# EAGLE design LiPo Battery Meter (EAGLE 6.5.0)
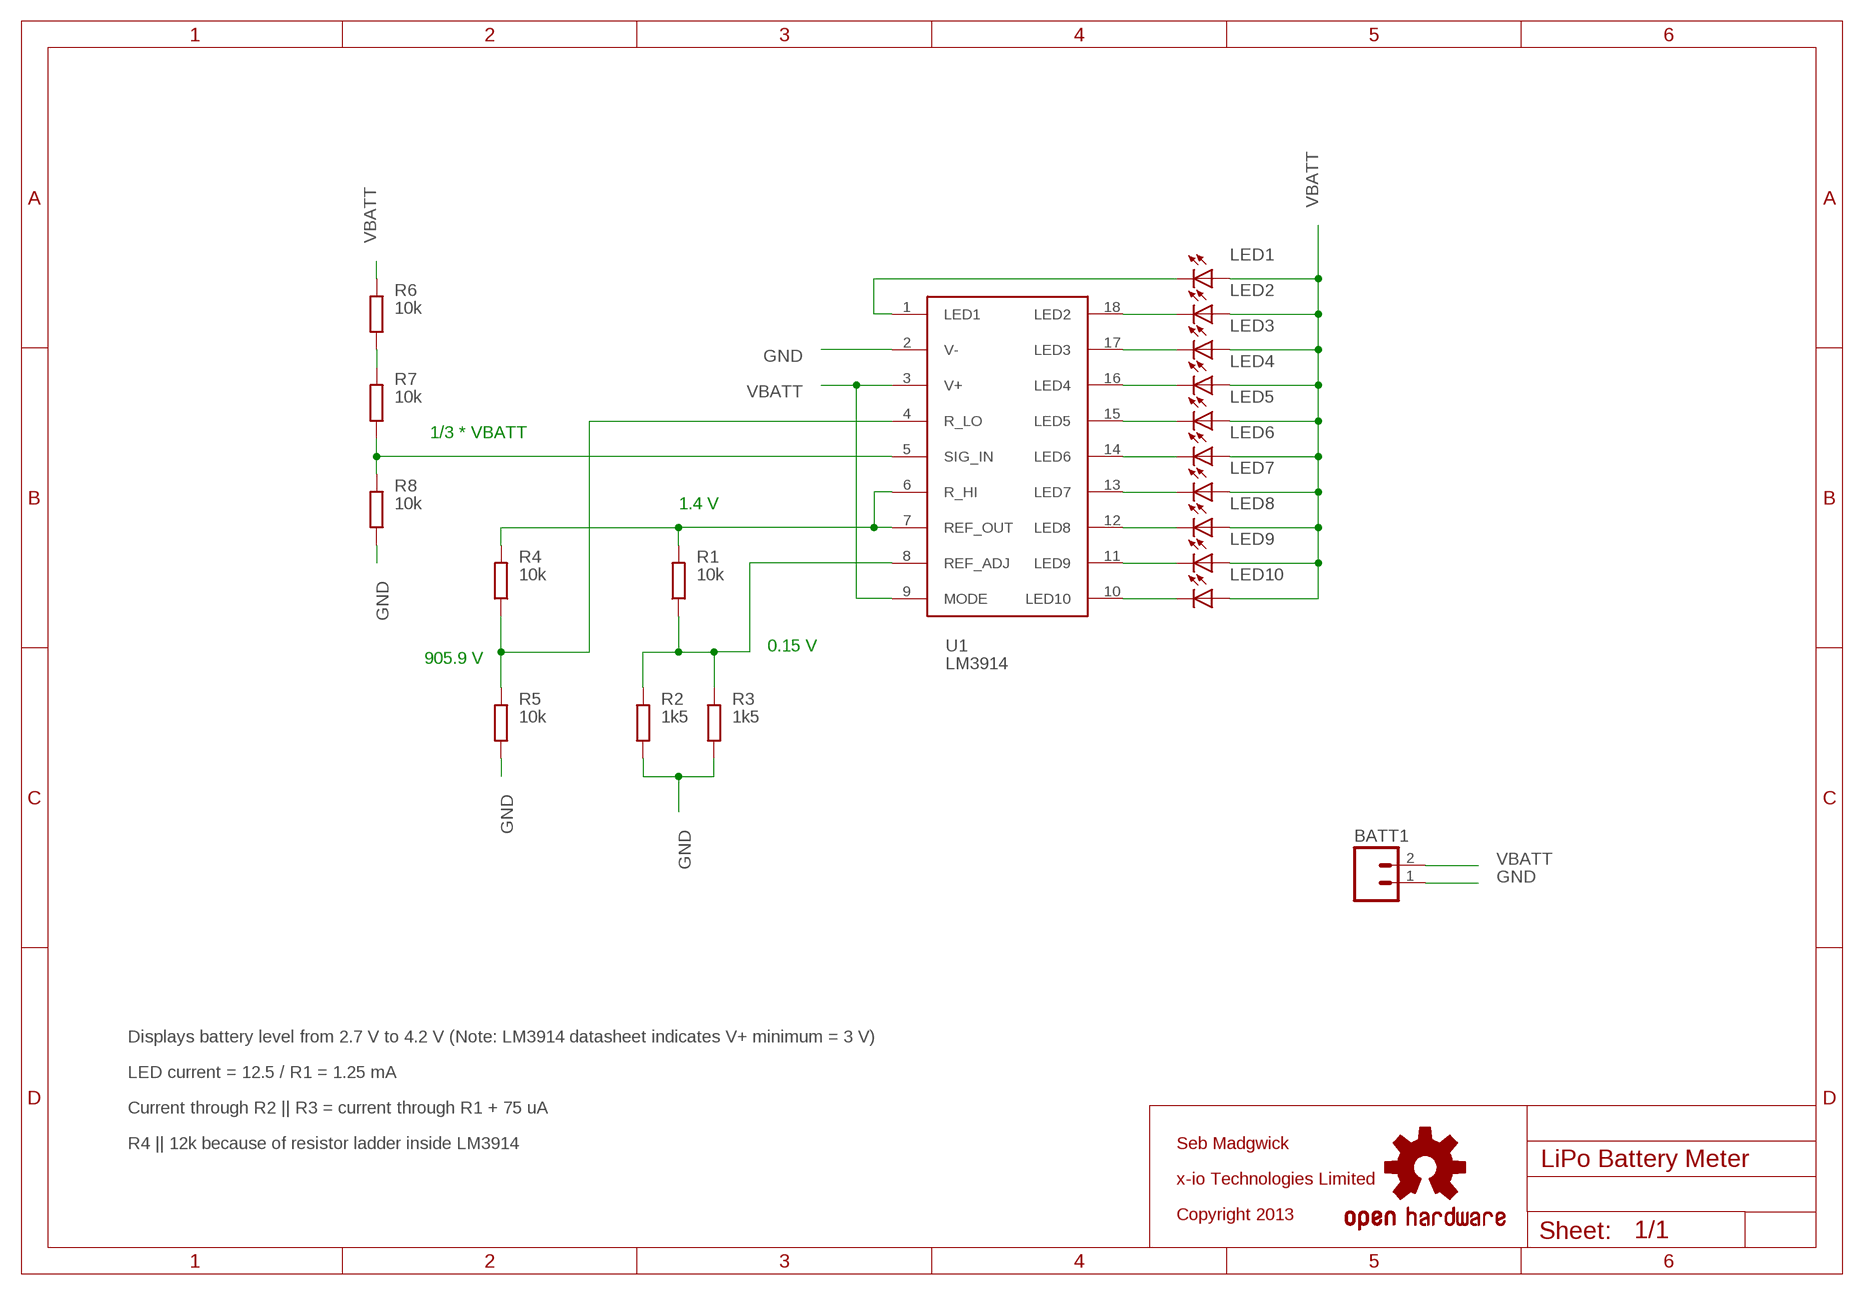
[diagram p0: schematic, sheet 1]

## Parts
BATT1  M02-JST-2MM-SMT  [S2B-PH]
LED1  LEDCHIPLED_1206  [CHIPLED_1206]
LED2  LEDCHIPLED_1206  [CHIPLED_1206]
LED3  LEDCHIPLED_1206  [CHIPLED_1206]
LED4  LEDCHIPLED_1206  [CHIPLED_1206]
LED5  LEDCHIPLED_1206  [CHIPLED_1206]
LED6  LEDCHIPLED_1206  [CHIPLED_1206]
LED7  LEDCHIPLED_1206  [CHIPLED_1206]
LED8  LEDCHIPLED_1206  [CHIPLED_1206]
LED9  LEDCHIPLED_1206  [CHIPLED_1206]
LED10  LEDCHIPLED_1206  [CHIPLED_1206]
R1  10k  R-EU_M1206  [M1206]
R2  1k5  R-EU_M1206  [M1206]
R3  1k5  R-EU_M1206  [M1206]
R4  10k  R-EU_M1206  [M1206]
R5  10k  R-EU_M1206  [M1206]
R6  10k  R-EU_M1206  [M1206]
R7  10k  R-EU_M1206  [M1206]
R8  10k  R-EU_M1206  [M1206]
U1  LM3914  [DIL18]
U$2  OSHW-LOGOM  [OSHW-LOGO-M]

## Nets
GND: BATT1.1 R2.1 R3.1 R5.1 R8.1 U1.2(V-)
N$2: R4.1 R5.2 U1.4(R_LO)
N$4: R7.1 R8.2 U1.5(SIG_IN)
N$5: R6.1 R7.2
N$6: R1.1 R2.2 R3.2 U1.8(REF_ADJ)
N$7: LED10.C U1.10(LED10)
N$8: LED9.C U1.11(LED9)
N$9: LED8.C U1.12(LED8)
N$10: LED7.C U1.13(LED7)
N$11: LED6.C U1.14(LED6)
N$12: LED5.C U1.15(LED5)
N$13: LED4.C U1.16(LED4)
N$14: LED3.C U1.17(LED3)
N$15: LED2.C U1.18(LED2)
N$16: LED1.C U1.1(LED1)
REF_OUT: R1.2 R4.2 U1.6(R_HI) U1.7(REF_OUT)
VBATT: BATT1.2 LED1.A LED2.A LED3.A LED4.A LED5.A LED6.A LED7.A LED8.A LED9.A LED10.A R6.2 U1.3(V+) U1.9(MODE)

## Notes on the sheet
- 1/3 * VBATT
- 1.4 V
- 905.9 V | 0.15 V
- Displays battery level from 2.7 V to 4.2 V (Note: LM3914 datasheet indicates V+ minimum = 3 V)
- LED current = 12.5 / R1 = 1.25 mA
- Current through R2 || R3 = current through R1 + 75 uA
- R4 || 12k because of resistor ladder inside LM3914 | Seb Madgwick
- x-io Technologies Limited
- Copyright 2013

## Library data of the parts
BATT1 = SparkFun:M02: Header 2 Standard 2-pin 0.1" header. Use with straight break away headers (SKU : PRT-00116), right angle break away headers (PRT-00553), swiss pins (PRT-00743), machine pins (PRT-00117), and female headers (PRT-00115). Molex polarized connector foot print use with SKU : PRT-08233 with associated crimp pins and housings.
LED1-LED10 = led:LED: LED OSRAM: - CHIPLED LG R971, LG N971, LY N971, LG Q971, LY Q971, LO R971, LY R971 LH N974, LH R974 LS Q976, LO Q976, LY Q976 LO Q996 - Hyper CHIPLED LW Q18S LB Q993, LB Q99A, LB R99A - SideLED LS A670, LO A670, LY A670, LG A670, LP A670 LB A673, LV A673, LT A673, LW A673 LH A674 LY A675 LS A676, LA A676, LO A676, LY A676, LW A676 LS A679, LY A679, LG A679 - Hyper Micro SIDELED® LS Y876, LA Y876, LO Y876, LY Y876 LT Y87S - SmartLED LW L88C, LW L88S LB L89C, LB L89S, LG L890 LS L89K, LO L89K, LY L89K LS L896, LA L896, LO L896, LY L896 - TOPLED LS T670, LO T670, LY T670, LG T670, LP T670 LSG T670, LSP T670, LSY T670, LOP T670, LYG T670 LG T671, LOG T671, LSG T671 LB T673, LV T673, LT T673, LW T673 LH T674 LS T676, LA T676, LO T676, LY T676, LB T676, LH T676, LSB T676, LW T676 LB T67C, LV T67C, LT T67C, LS T67K, LO T67K, LY T67K, LW E67C LS E67B, LA E67B, LO E67B, LY E67B, LB E67C, LV E67C, LT E67C LW T67C LS T679, LY T679, LG T679 LS T770, LO T770, LY T770, LG T770, LP T770 LB T773, LV T773, LT T773, LW T773 LH T774 LS E675, LA E675, LY E675, LS T675 LS T776, LA T776, LO T776, LY T776, LB T776 LHGB T686 LT T68C, LB T68C - Hyper Mini TOPLED® LB M676 - Mini TOPLED Santana® LG M470 LS M47K, LO M47K, LY M47K Source: http://www.osram.convergy.de - LUMILED® LXK2-PW12-R00, LXK2-PW12-S00, LXK2-PW14-U00, LXK2-PW14-V00 LXK2-PM12-R00, LXK2-PM12-S00, LXK2-PM14-U00 LXK2-PE12-Q00, LXK2-PE12-R00, LXK2-PE12-S00, LXK2-PE14-T00, LXK2-PE14-U00 LXK2-PB12-K00, LXK2-PB12-L00, LXK2-PB12-M00, LXK2-PB14-N00, LXK2-PB14-P00, LXK2-PB14-Q00 LXK2-PR12-L00, LXK2-PR12-M00, LXK2-PR14-Q00, LXK2-PR14-R00 LXK2-PD12-Q00, LXK2-PD12-R00, LXK2-PD12-S00 LXK2-PH12-R00, LXK2-PH12-S00 LXK2-PL12-P00, LXK2-PL12-Q00, LXK2-PL12-R00 Source: www.luxeon.com
R1-R8 = rcl:R-EU_: RESISTOR, European symbol
U1 = x-io:LM3914
U$2 = SparkFun_08_2011:OSHW-LOGO: Open Source Hardware Logo This logo indicates the piece of hardware it is found on incorporates a OSHW license and/or adheres to the definition of open source hardware found here: http://freedomdefined.org/OSHW

## Board
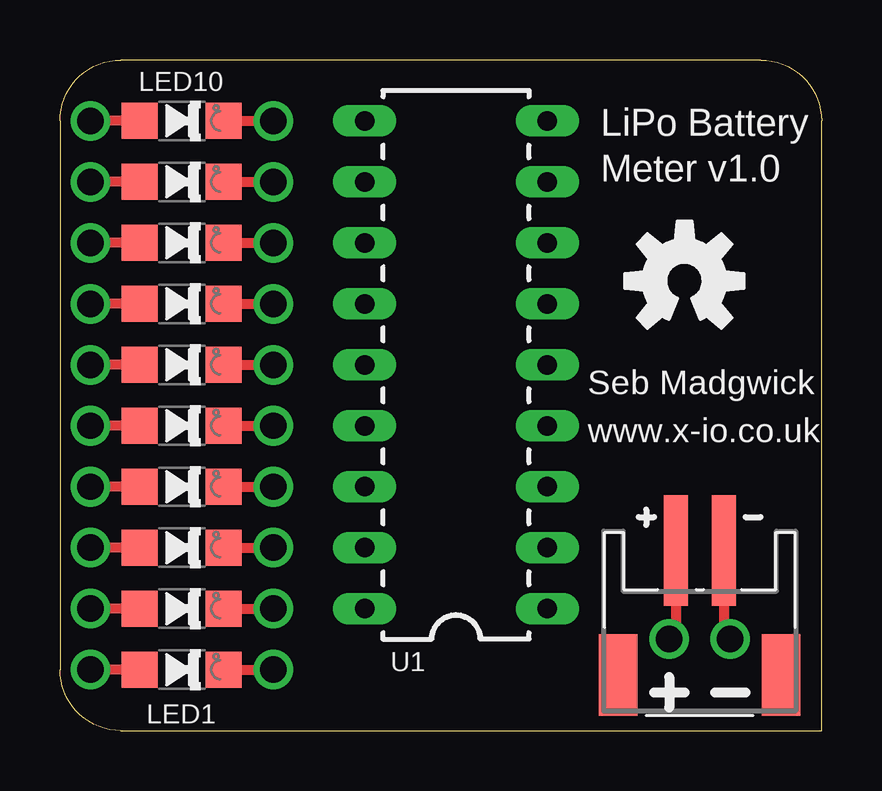
[diagram p1: board, top side]
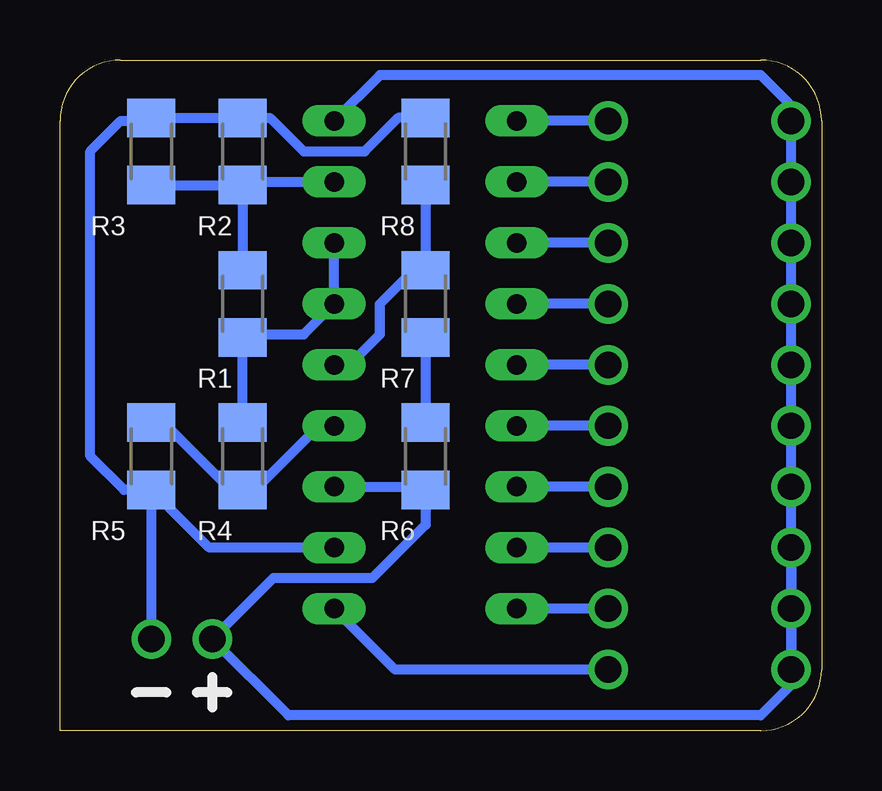
[diagram p2: board, bottom side, seen from below]

Size 31.75 x 27.94 mm. Coordinates in mm from the lower left corner, seen from the top.
Outline: 2.54,0 31.75,0 31.75,25.4 arc90 29.21,27.94 2.54,27.94 arc90 0,25.4 0,2.54 arc90 2.54,0
Copper layers (1*16): Top 0.035mm / dielectric 1.5mm / Bottom 0.035mm
Design rules "default *": minimum track width 0.15mm, minimum drill 0.3mm, track to track 0.15mm, track to pad 0.15mm, pad to pad 0.15mm, via to via 0.15mm, smd to smd 0.15mm, copper to edge 0.2mm, drill to drill 0.15mm, minimum pad ring 10mil, minimum via ring 8mil, stop-mask expansion 4mil, vias tented up to drill 1mm, thermal gap 0.195mm

### Footprints (pad centres in the part's own frame; a part is rotated, then mirrored left to right if it is on the bottom)
S2B-PH = smd 1 x 4.6: 1 -1,-3.7; 2 1,-3.7 | smd 1.6 x 3.4: NC1 -3.4,1.5; NC2 3.4,1.5
CHIPLED_1206 = smd 1.5 x 1.5: A 0,-1.75; C 0,1.75
M1206 = smd 1.6 x 2: 1 -1.4,0; 2 1.4,0
DIL18 = drill 0.813 long: 1 -10.16,-3.81; 2 -7.62,-3.81; 3 -5.08,-3.81; 4 -2.54,-3.81; 5 0,-3.81; 6 2.54,-3.81; 7 5.08,-3.81; 8 7.62,-3.81; 9 10.16,-3.81; 10 10.16,3.81; 11 7.62,3.81; 12 5.08,3.81; 13 2.54,3.81; 14 0,3.81; 15 -2.54,3.81; 16 -5.08,3.81; 17 -7.62,3.81; 18 -10.16,3.81

### Placement (x,y rotation side)
BATT1  26.67,3.81 180 top
LED1  5.08,2.54 270 top
LED2  5.08,5.08 270 top
LED3  5.08,7.62 270 top
LED4  5.08,10.16 270 top
LED5  5.08,12.7 270 top
LED6  5.08,15.24 270 top
LED7  5.08,17.78 270 top
LED8  5.08,20.32 270 top
LED9  5.08,22.86 270 top
LED10  5.08,25.4 270 top
R1  24.13,17.78 270 bottom
R2  24.13,24.13 270 bottom
R3  27.94,24.13 270 bottom
R4  24.13,11.43 90 bottom
R5  27.94,11.43 90 bottom
R6  16.51,11.43 270 bottom
R7  16.51,17.78 270 bottom
R8  16.51,24.13 270 bottom
U1  16.51,15.24 90 top
U$1  [LIPO_BATTERY_METER_V1_0_BOTTOM]  0,0 0 top
U$2  26.04,18.73 0 top
U$3  [LIPO_BATTERY_METER_V1_0_TOP]  0,0 0 top

### Tracks (layer width: path | path; a pad name or v marks a point on that pad's centre or on a via)
GND  (via drill 1.1 pad 1.42)
  Top 0.406: BATT1.1 27.67,4.08 v27.94,3.81
  Bottom 0.406: U1.2 25.53,7.62 R5.1 | R5.1 v27.94,3.81 | R5.1 29.08,10.03 30.48,11.43 30.48,24.13 29.21,25.4 28.07,25.4 R3.1 R2.1 22.99,25.53 21.59,24.13 19.05,24.13 17.65,25.53 R8.1
N$2
  Bottom 0.406: U1.4 20.95,12.7 21.59,12.06 23.62,10.03 R4.1 24.64,10.03 27.3,12.7 27.81,12.7 R5.2
N$4
  Bottom 0.406: R8.2 R7.1 17.02,19.18 17.78,18.41 18.41,17.78 18.41,16.51 19.68,15.24 U1.5
N$5
  Bottom 0.406: R7.2 R6.1
N$6
  Bottom 0.406: R3.2 R2.2 | R2.2 24,22.86 U1.8 | R2.2 R1.1
N$7  (via drill 1.1 pad 1.42)
  Top 0.406: LED10.C v8.89,25.4
  Bottom 0.406: v8.89,25.4 U1.10
N$8  (via drill 1.1 pad 1.42)
  Top 0.406: LED9.C v8.89,22.86
  Bottom 0.406: v8.89,22.86 U1.11
N$9  (via drill 1.1 pad 1.42)
  Top 0.406: LED8.C v8.89,20.32
  Bottom 0.406: v8.89,20.32 U1.12
N$10  (via drill 1.1 pad 1.42)
  Top 0.406: LED7.C v8.89,17.78
  Bottom 0.406: v8.89,17.78 U1.13
N$11  (via drill 1.1 pad 1.42)
  Top 0.406: LED6.C v8.89,15.24
  Bottom 0.406: v8.89,15.24 U1.14
N$12  (via drill 1.1 pad 1.42)
  Top 0.406: LED5.C v8.89,12.7
  Bottom 0.406: v8.89,12.7 U1.15
N$13  (via drill 1.1 pad 1.42)
  Top 0.406: LED4.C v8.89,10.16
  Bottom 0.406: v8.89,10.16 U1.16
N$14  (via drill 1.1 pad 1.42)
  Top 0.406: LED3.C v8.89,7.62
  Bottom 0.406: v8.89,7.62 U1.17
N$15  (via drill 1.1 pad 1.42)
  Top 0.406: LED2.C v8.89,5.08
  Bottom 0.406: v8.89,5.08 U1.18
N$16  (via drill 1.1 pad 1.42)
  Top 0.406: LED1.C v8.89,2.54
  Bottom 0.406: v8.89,2.54 17.78,2.54 U1.1
REF_OUT
  Bottom 0.406: R4.2 R1.2 24,16.51 21.59,16.51 U1.6 U1.7
VBATT  (via drill 1.1 pad 1.42)
  Top 0.406: LED10.A v1.27,25.4 | LED1.A v1.27,2.54 | LED2.A v1.27,5.08 | LED4.A v1.27,10.16 | LED5.A v1.27,12.7 | LED6.A v1.27,15.24 | LED7.A v1.27,17.78 | LED8.A v1.27,20.32 | LED9.A v1.27,22.86 | BATT1.2 25.67,4.08 v25.4,3.81 | LED3.A v1.27,7.62
  Bottom 0.406: v1.27,2.54 v1.27,5.08 v1.27,7.62 | v1.27,7.62 v1.27,10.16 v1.27,12.7 v1.27,15.24 v1.27,17.78 v1.27,20.32 v1.27,22.86 v1.27,25.4 1.27,26.04 2.54,27.3 18.41,27.3 U1.9 | v1.27,7.62 1.27,1.91 2.54,0.64 22.23,0.64 v25.4,3.81 22.86,6.35 18.73,6.35 16.51,8.57 16.51,10.16 U1.3 16.64,10.16 R6.2

### Text on the board
_tsilk: LiPo Battery | Meter v1.0 | Seb Madgwick | www.x-io.co.uk